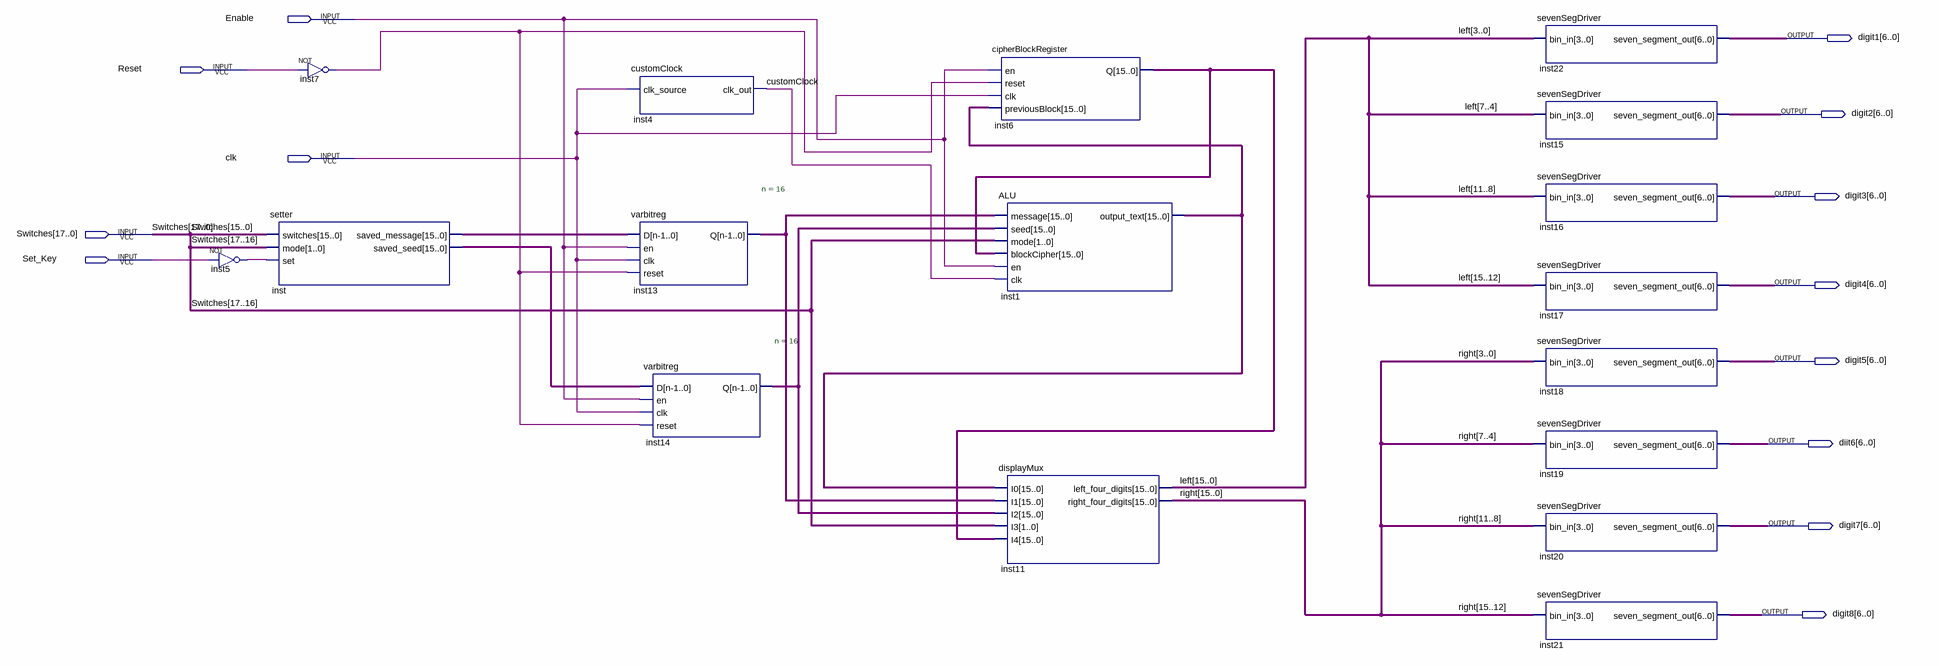
[diagram p0: schematic sheet]
// Quartus schematic main.bdf as structural Verilog: 17 symbols, 13 pins
module main (
  input  Enable,
  input  Reset,
  input  clk,
  input  [17:0] Switches,
  input  Set_Key,
  output [6:0] digit1,
  output [6:0] digit2,
  output [6:0] digit3,
  output [6:0] digit4,
  output [6:0] digit5,
  output [6:0] diit6,
  output [6:0] digit7,
  output [6:0] digit8
);

  wire customClock, inst5_out, inst7_out;
  wire [15:0] inst1_output_text, inst6_q, inst13_q, inst14_q, inst_saved_message, inst_saved_seed, left,
       right;

  not inst5 (inst5_out, Set_Key);
  not inst7 (inst7_out, Reset);
  setter inst (
    .switches(Switches[15:0]), .mode(Switches[17:16]), .set(inst5_out), .saved_message(inst_saved_message),
    .saved_seed(inst_saved_seed));
  customClock inst4 (.clk_source(clk), .clk_out(customClock));
  varbitreg #(.n(16)) inst13 (.D(inst_saved_message), .en(Enable), .clk(clk), .reset(inst7_out), .Q(inst13_q));
  varbitreg #(.n(16)) inst14 (.D(inst_saved_seed), .en(Enable), .clk(clk), .reset(inst7_out), .Q(inst14_q));
  cipherBlockRegister inst6 (.en(Enable), .reset(inst7_out), .clk(clk), .previousBlock(inst1_output_text), .Q(inst6_q));
  ALU inst1 (
    .message(inst13_q), .seed(inst14_q), .mode(Switches[17:16]), .blockCipher(inst6_q), .en(Enable),
    .clk(customClock), .output_text(inst1_output_text));
  displayMux inst11 (
    .I0(inst1_output_text), .I1(inst13_q), .I2(inst14_q), .I3(Switches[17:16]), .I4(inst6_q),
    .left_four_digits(left), .right_four_digits(right));
  sevenSegDriver inst22 (.bin_in(left[3:0]), .seven_segment_out(digit1));
  sevenSegDriver inst15 (.bin_in(left[7:4]), .seven_segment_out(digit2));
  sevenSegDriver inst16 (.bin_in(left[11:8]), .seven_segment_out(digit3));
  sevenSegDriver inst17 (.bin_in(left[15:12]), .seven_segment_out(digit4));
  sevenSegDriver inst18 (.bin_in(right[3:0]), .seven_segment_out(digit5));
  sevenSegDriver inst19 (.bin_in(right[7:4]), .seven_segment_out(diit6));
  sevenSegDriver inst20 (.bin_in(right[11:8]), .seven_segment_out(digit7));
  sevenSegDriver inst21 (.bin_in(right[15:12]), .seven_segment_out(digit8));
endmodule
